# Altium schematic sheet Block Diagram.SchDoc
size A3; Revision: AA; SheetNumber: 1; SheetTotal: 3; ProjectDescription: Turkish Coffee Machine; preparedBy: Furkan Çağatay Ekinci; ReleaseDate: 22.12.2023; changedDate: 22.12.2023
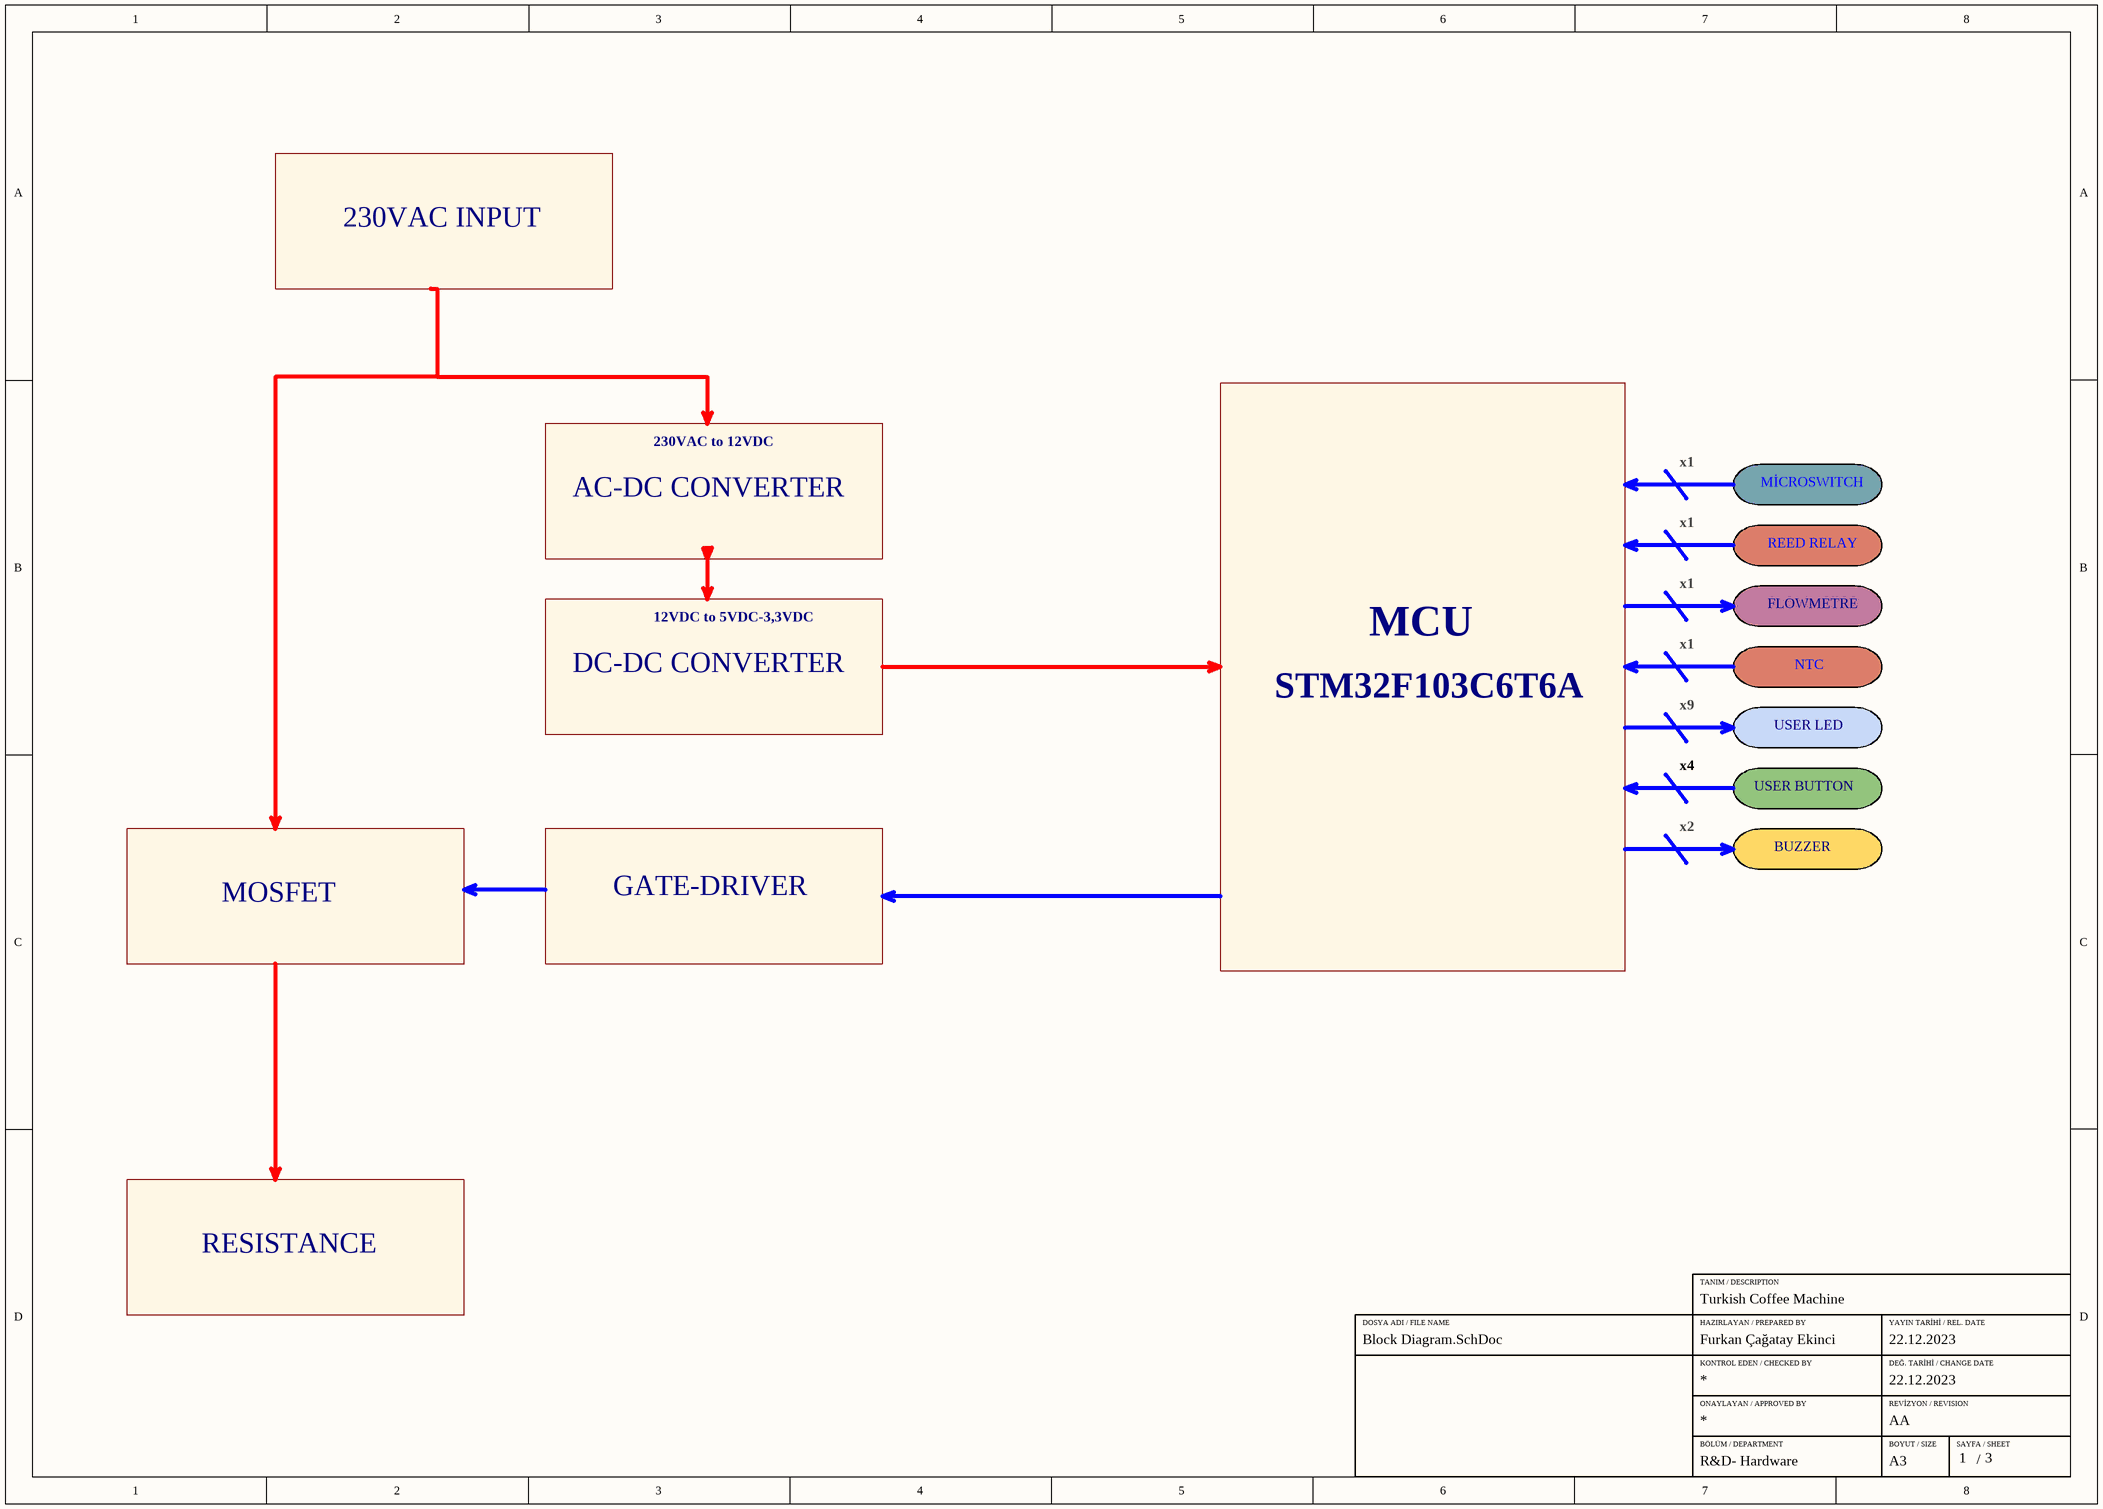
[diagram p0: Block Diagram.SchDoc]

## Notes on the sheet
- 230VAC INPUT
- 230VAC to 12VDC
- AC-DC CONVERTER
- x1
- MİCROSWITCH
- REED RELAY
- 12VDC to 5VDC-3,3VDC
- MCU
- FLOWMETRE
- DC-DC CONVERTER
- STM32F103C6T6A
- x9
- NTC
- x4
- USER LED
- x2
- USER BUTTON
- BUZZER
- MOSFET
- GATE-DRIVER
- RESISTANCE
- DOSYA ADI / FILE NAME
- HAZIRLAYAN / PREPARED BY
- TANIM / DESCRIPTION
- YAYIN TARİHİ / REL. DATE
- KONTROL EDEN / CHECKED BY
- DEĞ. TARİHİ / CHANGE DATE
- ONAYLAYAN / APPROVED BY
- BÖLÜM / DEPARTMENT
- BOYUT / SIZE
- REVİZYON / REVISION
- SAYFA / SHEET
- /
- R&D- Hardware
- A3